# Altium schematic sheet CPU_SDIO_UART_I2C_I2C.SchDoc
size A3; SheetNumber: 10; SheetTotal: 21
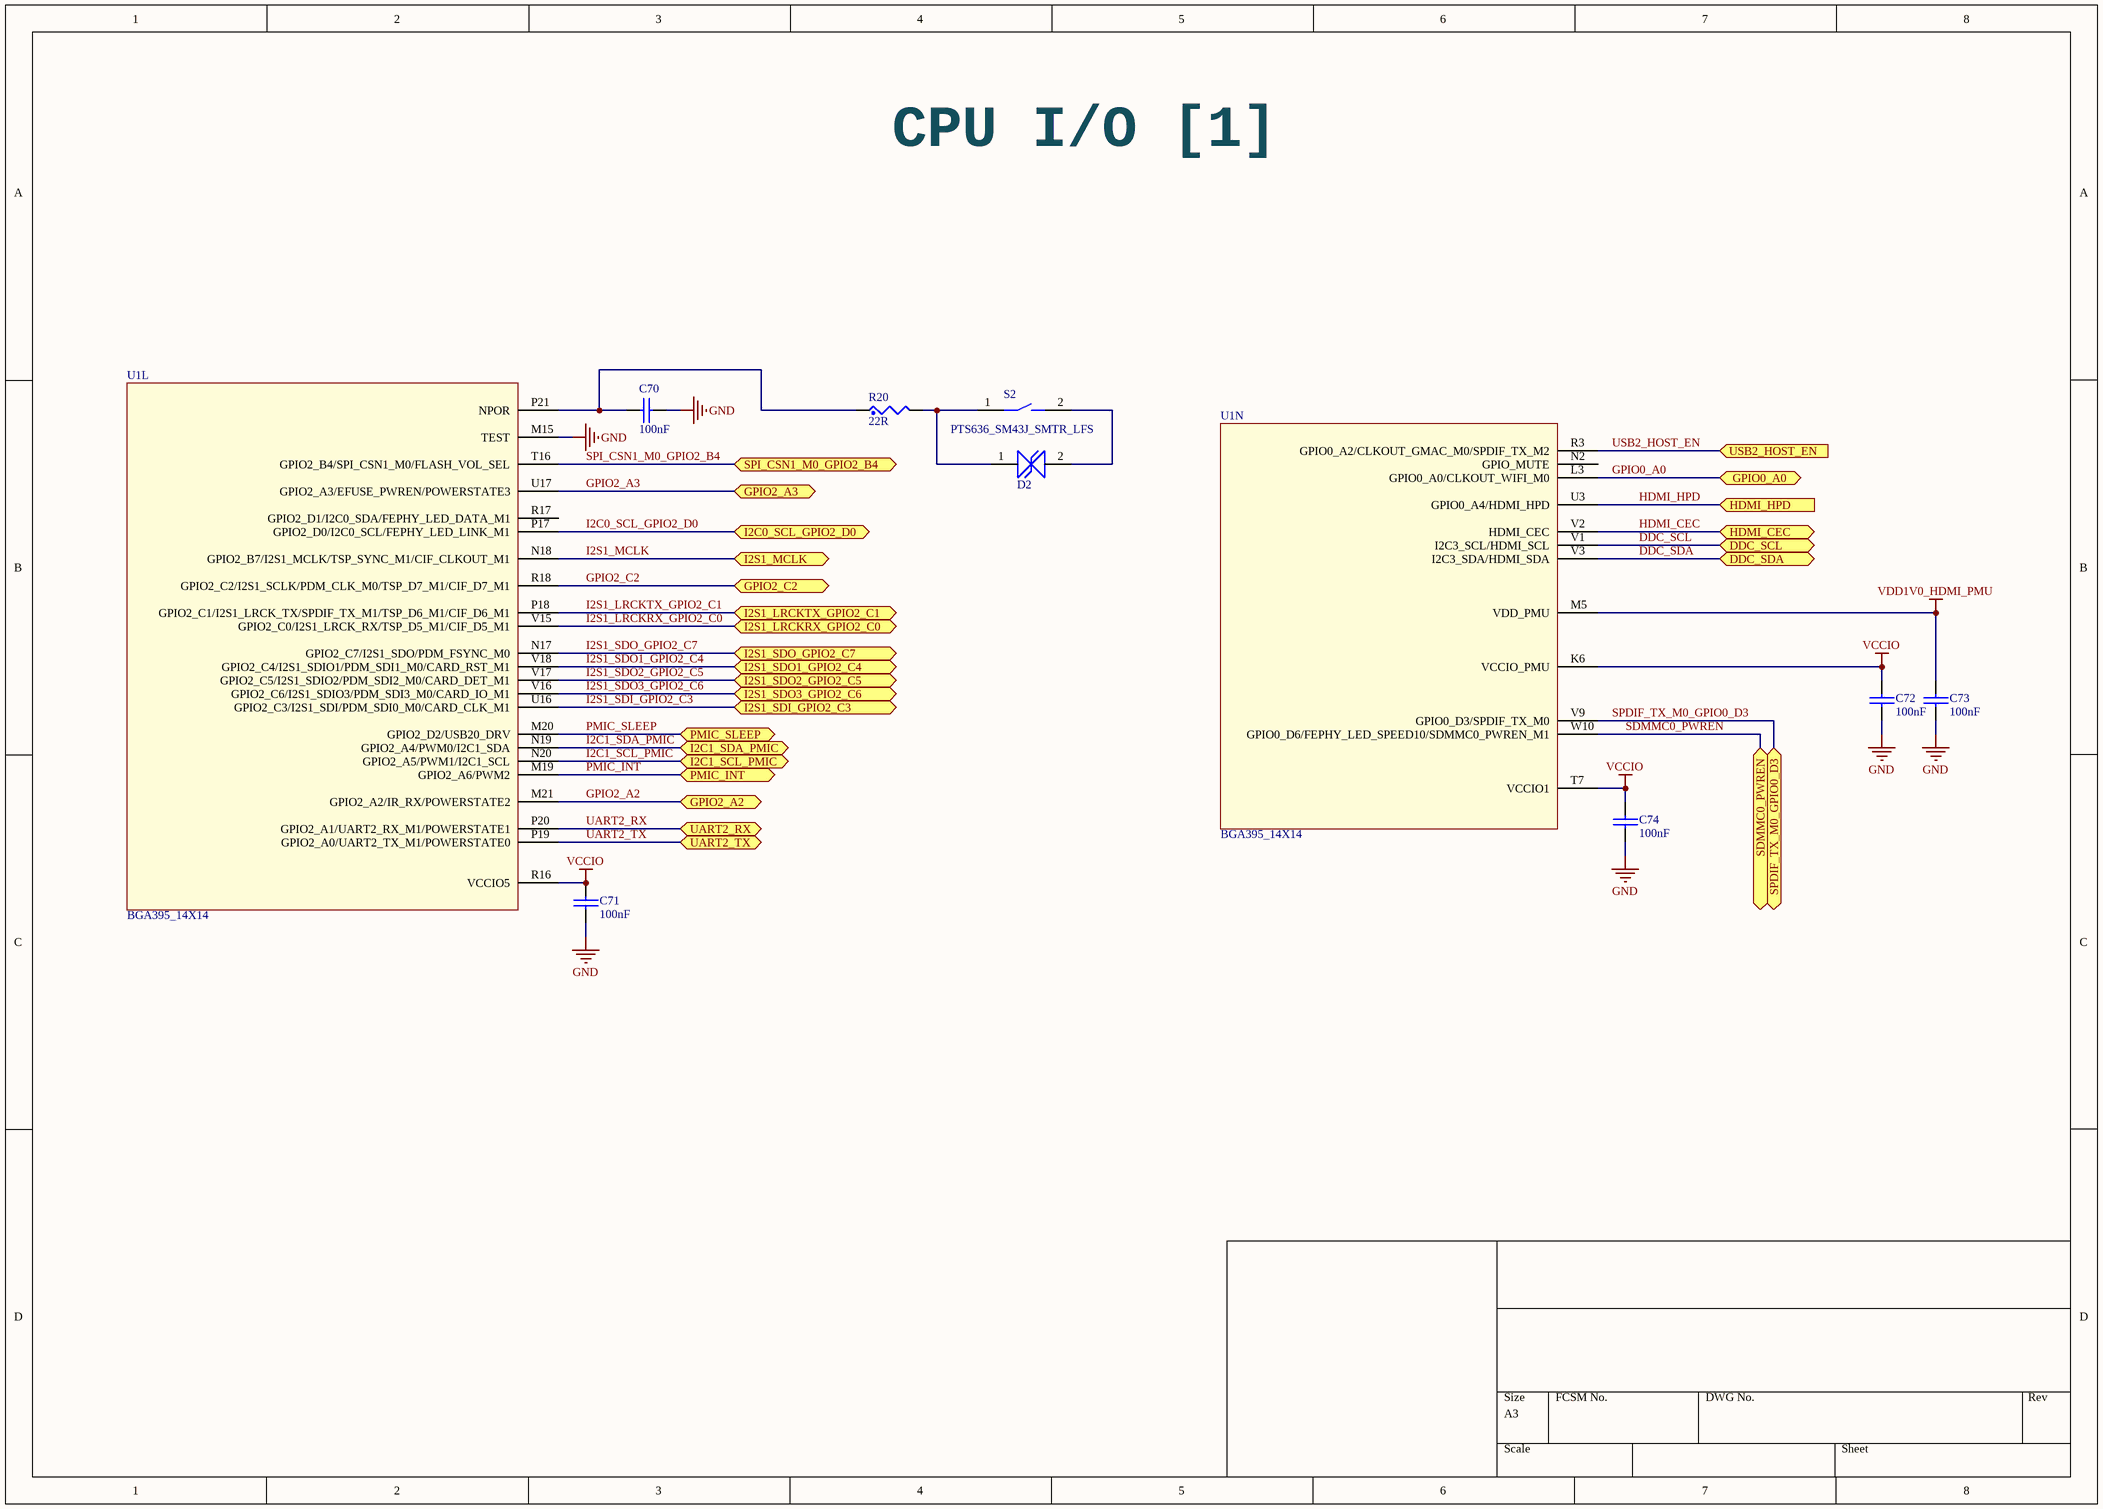
[diagram p0: CPU_SDIO_UART_I2C_I2C.SchDoc]

## Parts
C70  100nF  [0402_CC - C]
C71  100nF  [0402_CC - C]
C72  100nF  [0402_CC - C]
C73  100nF  [0402_CC - C]
C74  100nF  [0402_CC - C]
D2  TVS  [SODFL100X45-2N]  (value not drawn)
R20  22R  [0402_CR]
S2  PTS636_SM43J_SMTR_LFS  [PTS636_3.5_6_4.3]
U1  BGA395_14X14  [BGA395C65P21X21_1750X1750X117]  (parts L,N of 17)

## Ports
DDC_SCL (bidir), DDC_SDA (bidir), GPIO0_A0 (bidir), GPIO2_A2 (bidir), GPIO2_A3 (bidir), GPIO2_C2 (bidir), HDMI_CEC (bidir), HDMI_HPD (in), I2C0_SCL_GPIO2_D0 (bidir), I2C1_SCL_PMIC (bidir), I2C1_SDA_PMIC (bidir), I2S1_LRCKRX_GPIO2_C0 (bidir), I2S1_LRCKTX_GPIO2_C1 (bidir), I2S1_MCLK (bidir), I2S1_SDI_GPIO2_C3 (bidir), I2S1_SDO1_GPIO2_C4 (bidir), I2S1_SDO2_GPIO2_C5 (bidir), I2S1_SDO3_GPIO2_C6 (bidir), I2S1_SDO_GPIO2_C7 (bidir), PMIC_INT (bidir), PMIC_SLEEP (bidir), SDMMC0_PWREN (bidir), SPDIF_TX_M0_GPIO0_D3 (bidir), SPI_CSN1_M0_GPIO2_B4 (bidir), UART2_RX (bidir), UART2_TX (bidir), USB2_HOST_EN (in)

## Nets
GND: C70.2 C71.1 C72.1 C73.1 C74.1 U1.M15(TEST)
VCCIO: C71.2 C72.2 C74.2 U1.K6(VCCIO_PMU) U1.R16(VCCIO5) U1.T7(VCCIO1)
VDD1V0_HDMI_PMU: C73.2 U1.M5(VDD_PMU)
DDC_SCL: U1.V1(I2C3_SCL/HDMI_SCL) ; port DDC_SCL
DDC_SDA: U1.V3(I2C3_SDA/HDMI_SDA) ; port DDC_SDA
GPIO0_A0: U1.L3(GPIO0_A0/CLKOUT_WIFI_M0) ; port GPIO0_A0
GPIO2_A2: U1.M21(GPIO2_A2/IR_RX/POWERSTATE2) ; port GPIO2_A2
GPIO2_A3: U1.U17(GPIO2_A3/EFUSE_PWREN/POWERSTATE3) ; port GPIO2_A3
GPIO2_C2: U1.R18(GPIO2_C2/I2S1_SCLK/PDM_CLK_M0/TSP_D7_M1/CIF_D7_M1) ; port GPIO2_C2
HDMI_CEC: U1.V2(HDMI_CEC) ; port HDMI_CEC
HDMI_HPD: U1.U3(GPIO0_A4/HDMI_HPD) ; port HDMI_HPD
I2C0_SCL_GPIO2_D0: U1.P17(GPIO2_D0/I2C0_SCL/FEPHY_LED_LINK_M1) ; port I2C0_SCL_GPIO2_D0
I2C1_SCL_PMIC: U1.N20(GPIO2_A5/PWM1/I2C1_SCL) ; port I2C1_SCL_PMIC
I2C1_SDA_PMIC: U1.N19(GPIO2_A4/PWM0/I2C1_SDA) ; port I2C1_SDA_PMIC
I2S1_LRCKRX_GPIO2_C0: U1.V15(GPIO2_C0/I2S1_LRCK_RX/TSP_D5_M1/CIF_D5_M1) ; port I2S1_LRCKRX_GPIO2_C0
I2S1_LRCKTX_GPIO2_C1: U1.P18(GPIO2_C1/I2S1_LRCK_TX/SPDIF_TX_M1/TSP_D6_M1/CIF_D6_M1) ; port I2S1_LRCKTX_GPIO2_C1
I2S1_MCLK: U1.N18(GPIO2_B7/I2S1_MCLK/TSP_SYNC_M1/CIF_CLKOUT_M1) ; port I2S1_MCLK
I2S1_SDI_GPIO2_C3: U1.U16(GPIO2_C3/I2S1_SDI/PDM_SDI0_M0/CARD_CLK_M1) ; port I2S1_SDI_GPIO2_C3
I2S1_SDO1_GPIO2_C4: U1.V18(GPIO2_C4/I2S1_SDIO1/PDM_SDI1_M0/CARD_RST_M1) ; port I2S1_SDO1_GPIO2_C4
I2S1_SDO2_GPIO2_C5: U1.V17(GPIO2_C5/I2S1_SDIO2/PDM_SDI2_M0/CARD_DET_M1) ; port I2S1_SDO2_GPIO2_C5
I2S1_SDO3_GPIO2_C6: U1.V16(GPIO2_C6/I2S1_SDIO3/PDM_SDI3_M0/CARD_IO_M1) ; port I2S1_SDO3_GPIO2_C6
I2S1_SDO_GPIO2_C7: U1.N17(GPIO2_C7/I2S1_SDO/PDM_FSYNC_M0) ; port I2S1_SDO_GPIO2_C7
PMIC_INT: U1.M19(GPIO2_A6/PWM2) ; port PMIC_INT
PMIC_SLEEP: U1.M20(GPIO2_D2/USB20_DRV) ; port PMIC_SLEEP
SDMMC0_PWREN: U1.W10(GPIO0_D6/FEPHY_LED_SPEED10/SDMMC0_PWREN_M1) ; port SDMMC0_PWREN
SPDIF_TX_M0_GPIO0_D3: U1.V9(GPIO0_D3/SPDIF_TX_M0) ; port SPDIF_TX_M0_GPIO0_D3
SPI_CSN1_M0_GPIO2_B4: U1.T16(GPIO2_B4/SPI_CSN1_M0/FLASH_VOL_SEL) ; port SPI_CSN1_M0_GPIO2_B4
UART2_RX: U1.P20(GPIO2_A1/UART2_RX_M1/POWERSTATE1) ; port UART2_RX
UART2_TX: U1.P19(GPIO2_A0/UART2_TX_M1/POWERSTATE0) ; port UART2_TX
USB2_HOST_EN: U1.R3(GPIO0_A2/CLKOUT_GMAC_M0/SPDIF_TX_M2) ; port USB2_HOST_EN
NetC70_1: C70.1 R20.1 U1.P21(NPOR)
NetD2_1: D2.1 R20.2 S2.1
NetD2_2: D2.2 S2.2

Not connected (* = marked no-connect by the designer): U1 N2(GPIO_MUTE) R17(GPIO2_D1/I2C0_SDA/FEPHY_LED_DATA_M1)

## Notes on the sheet
- CPU I/O [1]

## Library data of the parts
C70-C74 = CAP_NP: CLASS: DISCRETE
D2 = ESD5451N: AZ5825-01F, Bi-directional TVS, Working Voltage = 5V, Transient protection IEC61000-4-2 : +-30KV,  By AAR; Mfr_Part_No: ESD5451N-2/TR; ComponentLink1Description: Supplier; ComponentLink1URL: https://lcsc.com/product-detail/TVS_Will-Semicon-ESD5451N-2-TR_C239604.html; LCSC Part #: C239604; Package/Case: =Footprint
R20 = RES: CLASS: DISCRETE
S2 = PTS636: Tactile Switches Tact 50mA 12VDC, 6.0x3.5, 4.3mm H, 180gf, J leads, No ground pin, Black Actuator; Mfr_Part_No: PTS636 SM43J SMTR LFS; Mouser No: 611-PTS636SM43JSMTRL
U1 = RK3328: By AAR